# EAGLE schematic fuitsu (EAGLE 6.5.0)
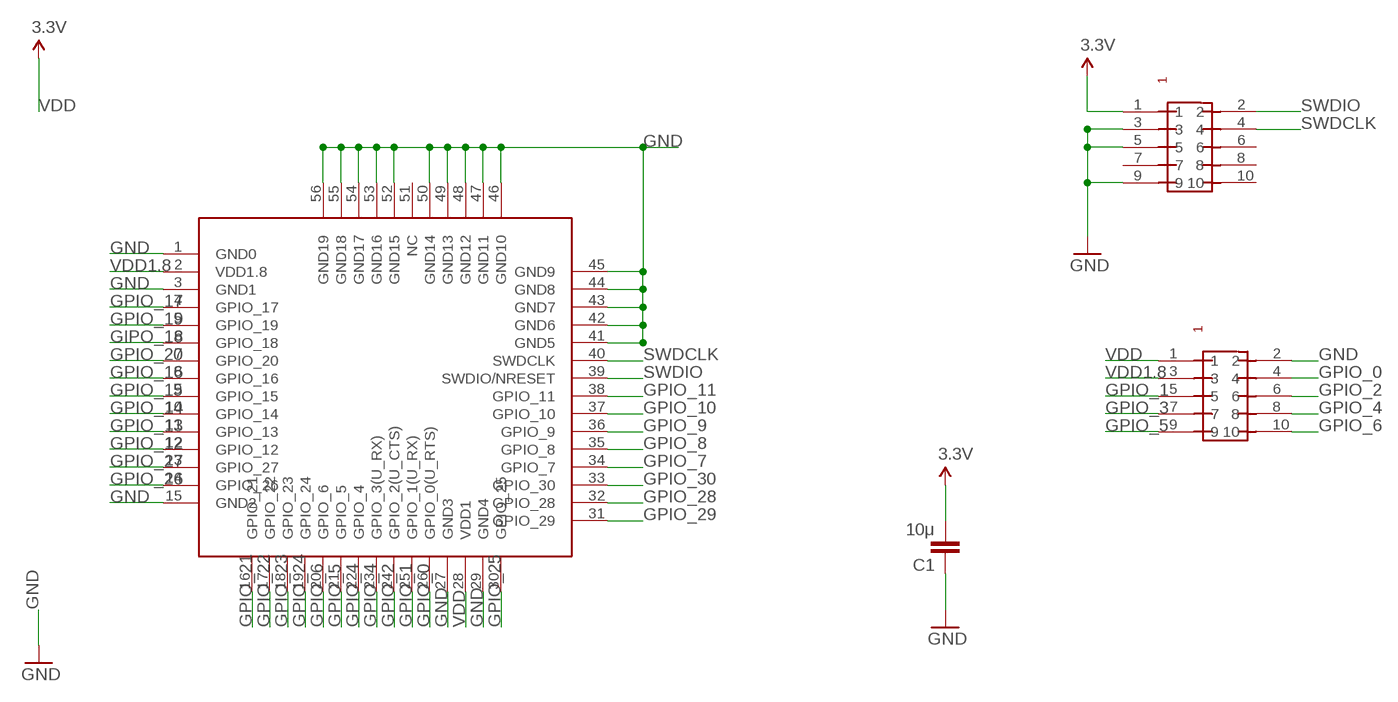
[diagram p0: schematic, sheet 1]

## Parts
C1  10μ  CAP0603-CAP  [0603-CAP]
U$1  FUJITSU-MBH7BLZ02  [FUJITSU-MBH7BLZ02]
U$2  PIN-HEADER-SMT(1.27MM)2X5  [PIN-HEADER-SMT(1.27MM)2X5]
U$3  PIN-HEADER-SMT(1.27MM)2X5  [PIN-HEADER-SMT(1.27MM)2X5]

## Nets
3.3V: C1.2 U$2.1
GIPO_18: U$1.6(GPIO_18)
GND: C1.1 U$1.1(GND0) U$1.3(GND1) U$1.15(GND2) U$1.27(GND3) U$1.29(GND4) U$1.41(GND5) U$1.42(GND6) U$1.43(GND7) U$1.44(GND8) U$1.45(GND9) U$1.46(GND10) U$1.47(GND11) U$1.48(GND12) U$1.49(GND13) U$1.50(GND14) U$1.52(GND15) U$1.53(GND16) U$1.54(GND17) U$1.55(GND18) U$1.56(GND19) U$2.3 U$2.5 U$2.9 U$3.2
GPIO_0: U$1.26(GPIO_0(U_RTS)) U$3.4
GPIO_1: U$1.25(GPIO_1(U_RX)) U$3.5
GPIO_2: U$1.24(GPIO_2(U_CTS)) U$3.6
GPIO_3: U$1.23(GPIO_3(U_RX)) U$3.7
GPIO_4: U$1.22(GPIO_4) U$3.8
GPIO_5: U$1.21(GPIO_5) U$3.9
GPIO_6: U$1.20(GPIO_6) U$3.10
GPIO_7: U$1.34(GPIO_7)
GPIO_8: U$1.35(GPIO_8)
GPIO_9: U$1.36(GPIO_9)
GPIO_10: U$1.37(GPIO_10)
GPIO_11: U$1.38(GPIO_11)
GPIO_12: U$1.12(GPIO_12)
GPIO_13: U$1.11(GPIO_13)
GPIO_14: U$1.10(GPIO_14)
GPIO_15: U$1.9(GPIO_15)
GPIO_16: U$1.8(GPIO_16)
GPIO_17: U$1.4(GPIO_17)
GPIO_19: U$1.5(GPIO_19)
GPIO_20: U$1.7(GPIO_20)
GPIO_21: U$1.16(GPIO_21)
GPIO_22: U$1.17(GPIO_22)
GPIO_23: U$1.18(GPIO_23)
GPIO_24: U$1.19(GPIO_24)
GPIO_25: U$1.30(GPIO_25)
GPIO_26: U$1.14(GPIO_26)
GPIO_27: U$1.13(GPIO_27)
GPIO_28: U$1.32(GPIO_28)
GPIO_29: U$1.31(GPIO_29)
GPIO_30: U$1.33(GPIO_30)
SWDCLK: U$1.40(SWDCLK) U$2.4
SWDIO: U$1.39(SWDIO/NRESET) U$2.2
VDD: U$1.28(VDD1) U$3.1 ; supply symbol labelled 3.3V
VDD1.8: U$1.2(VDD1.8) U$3.3
Unconnected: U$1.51(NC) U$2.6 U$2.7 U$2.8 U$2.10

## Library data of the parts
C1 = SparkFun:CAP: Capacitor Standard 0603 ceramic capacitor, and 0.1" leaded capacitor.
U$1 = blegadget20140308:FUJITSU-MBH7BLZ02
U$2 U$3 = gclue:PIN-HEADER-SMT(1.27MM)2X5: PIN-HEADER-SMT (1.27MM) 2x5